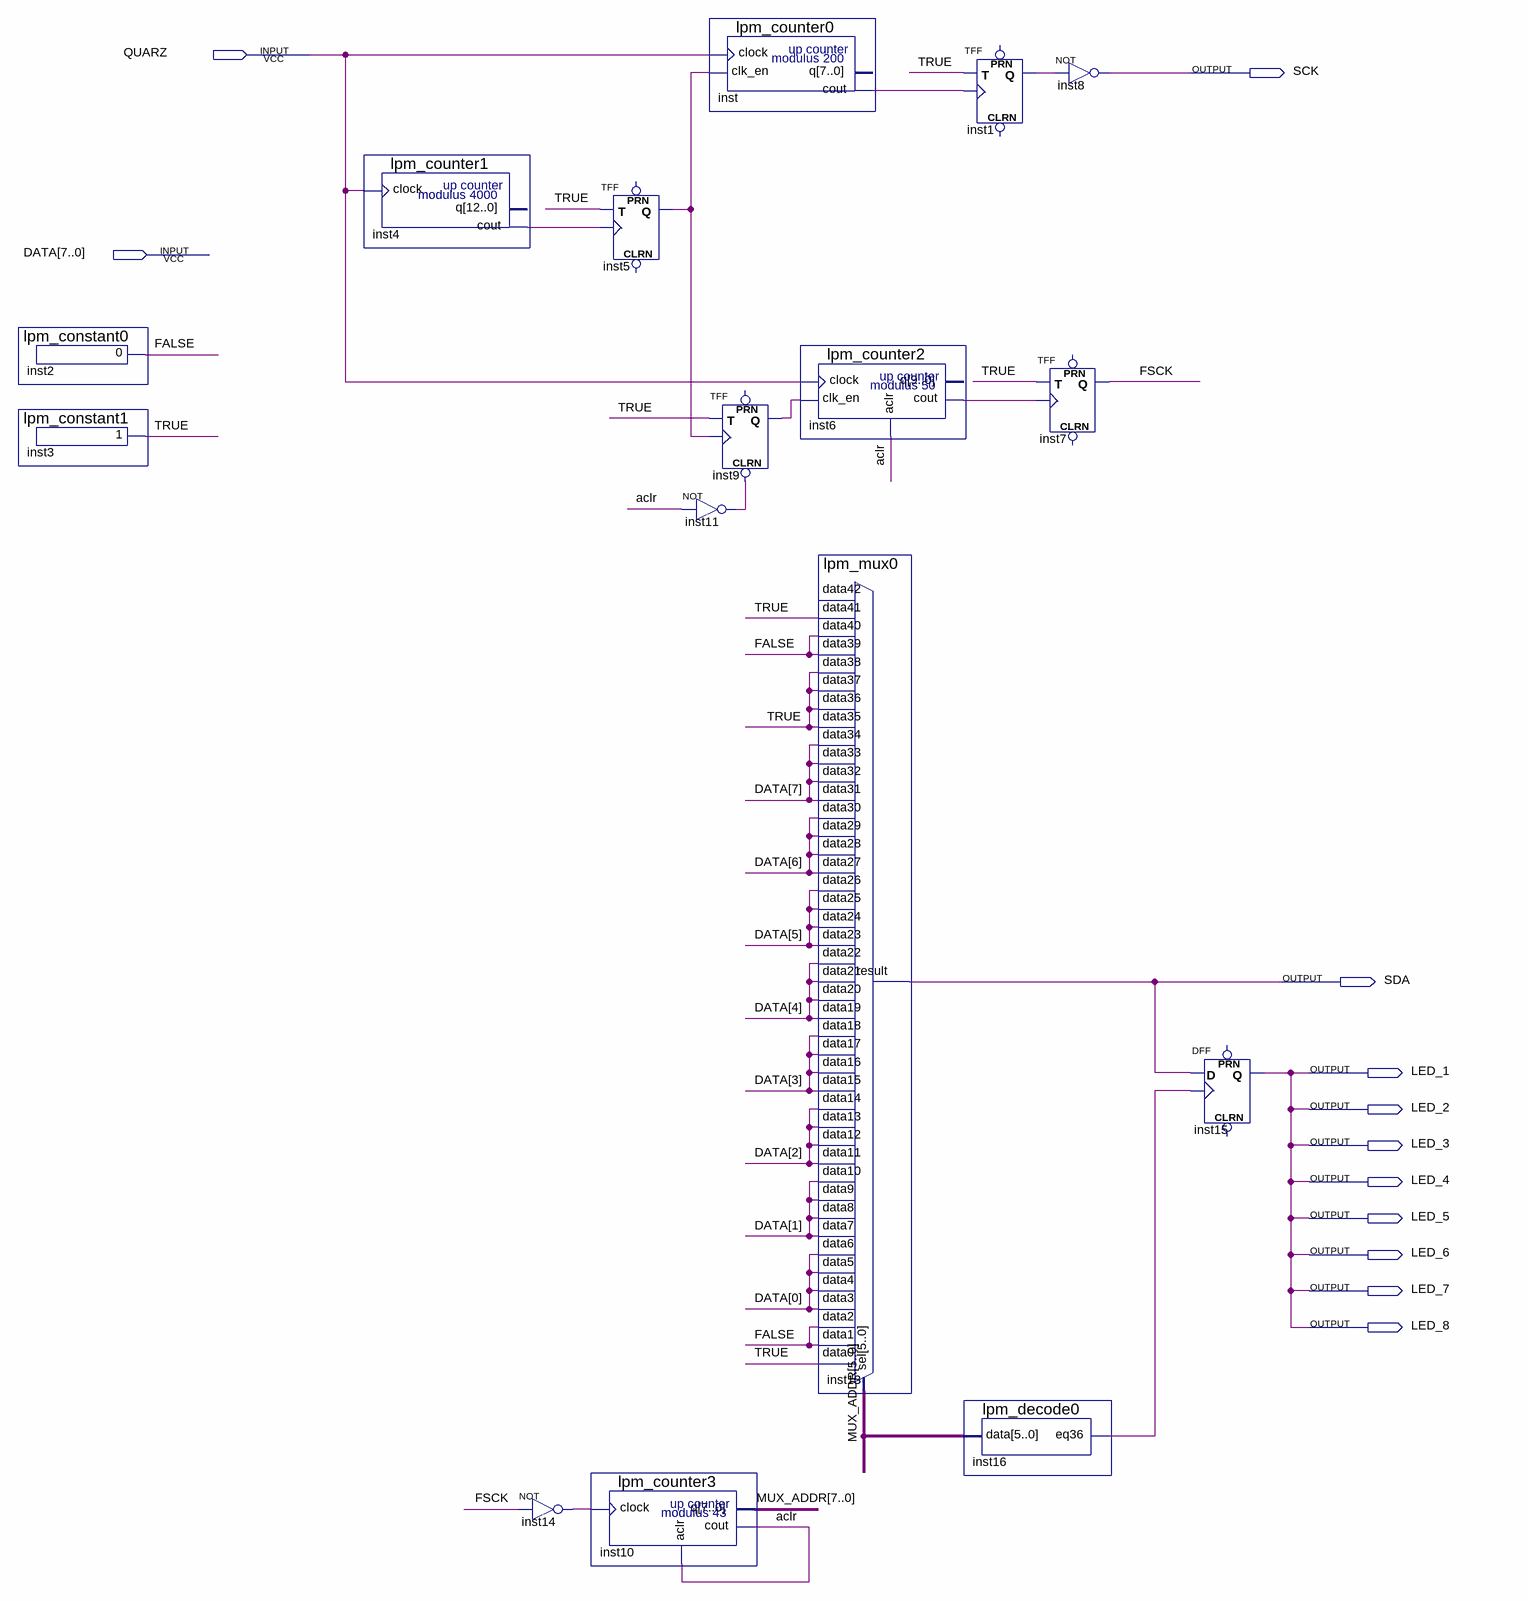
[diagram p0: schematic sheet]
// Quartus schematic i2c-new.bdf as structural Verilog: 16 symbols, 12 pins
module \i2c-new  (
  input  QUARZ,
  input  [7:0] DATA,
  output SCK,
  output SDA,
  output LED_1,
  output LED_2,
  output LED_3,
  output LED_4,
  output LED_5,
  output LED_6,
  output LED_7,
  output LED_8
);

  wire aclr, FALSE, FSCK, inst1_q, inst4_cout, inst5_q, inst6_cout, inst9_q, inst11_out, inst14_out,
       inst16_eq36, inst_cout, TRUE;
  wire [7:0] MUX_ADDR;

  lpm_constant0 inst2 (.result(FALSE));
  lpm_constant1 inst3 (.result(TRUE));
  lpm_counter1 inst4 (.clock(QUARZ), .cout(inst4_cout));  // open: q
  not inst14 (inst14_out, FSCK);
  TFF inst5 (.T(TRUE), .CLK(inst4_cout), .Q(inst5_q));  // open: PRN, CLRN
  lpm_counter3 inst10 (.clock(inst14_out), .aclr(aclr), .cout(aclr), .q(MUX_ADDR));
  lpm_counter0 inst (.clock(QUARZ), .clk_en(inst5_q), .cout(inst_cout));  // open: q
  TFF inst9 (.CLRN(inst11_out), .T(TRUE), .CLK(inst5_q), .Q(inst9_q));  // open: PRN
  not inst11 (inst11_out, aclr);
  lpm_counter2 inst6 (.clock(QUARZ), .clk_en(inst9_q), .aclr(aclr), .cout(inst6_cout));  // open: q
  lpm_mux0 inst13 (
    .data41(TRUE), .data40(FALSE), .data39(FALSE), .data38(TRUE), .data37(TRUE), .data36(TRUE),
    .data35(TRUE), .data34(DATA[7]), .data33(DATA[7]), .data32(DATA[7]), .data31(DATA[7]), .data30(DATA[6]),
    .data29(DATA[6]), .data28(DATA[6]), .data27(DATA[6]), .data26(DATA[5]), .data25(DATA[5]),
    .data24(DATA[5]), .data23(DATA[5]), .data22(DATA[4]), .data21(DATA[4]), .data20(DATA[4]),
    .data19(DATA[4]), .data18(DATA[3]), .data17(DATA[3]), .data16(DATA[3]), .data15(DATA[3]),
    .data14(DATA[2]), .data13(DATA[2]), .data12(DATA[2]), .data11(DATA[2]), .data10(DATA[1]),
    .data9(DATA[1]), .data8(DATA[1]), .data7(DATA[1]), .data6(DATA[0]), .data5(DATA[0]), .data4(DATA[0]),
    .data3(DATA[0]), .data2(FALSE), .data1(FALSE), .data0(TRUE), .sel(MUX_ADDR[5:0]), .result(SDA));  // open: data42
  TFF inst1 (.T(TRUE), .CLK(inst_cout), .Q(inst1_q));  // open: PRN, CLRN
  lpm_decode0 inst16 (.data(MUX_ADDR[5:0]), .eq36(inst16_eq36));
  not inst8 (SCK, inst1_q);
  TFF inst7 (.T(TRUE), .CLK(inst6_cout), .Q(FSCK));  // open: PRN, CLRN
  DFF inst15 (.CLK(inst16_eq36), .D(SDA), .Q(LED_1));  // open: CLRN, PRN

  assign LED_2 = LED_1;
  assign LED_3 = LED_1;
  assign LED_4 = LED_1;
  assign LED_5 = LED_1;
  assign LED_6 = LED_1;
  assign LED_7 = LED_1;
  assign LED_8 = LED_1;
endmodule
